# EAGLE design musicpulse (EAGLE 9.4.2)
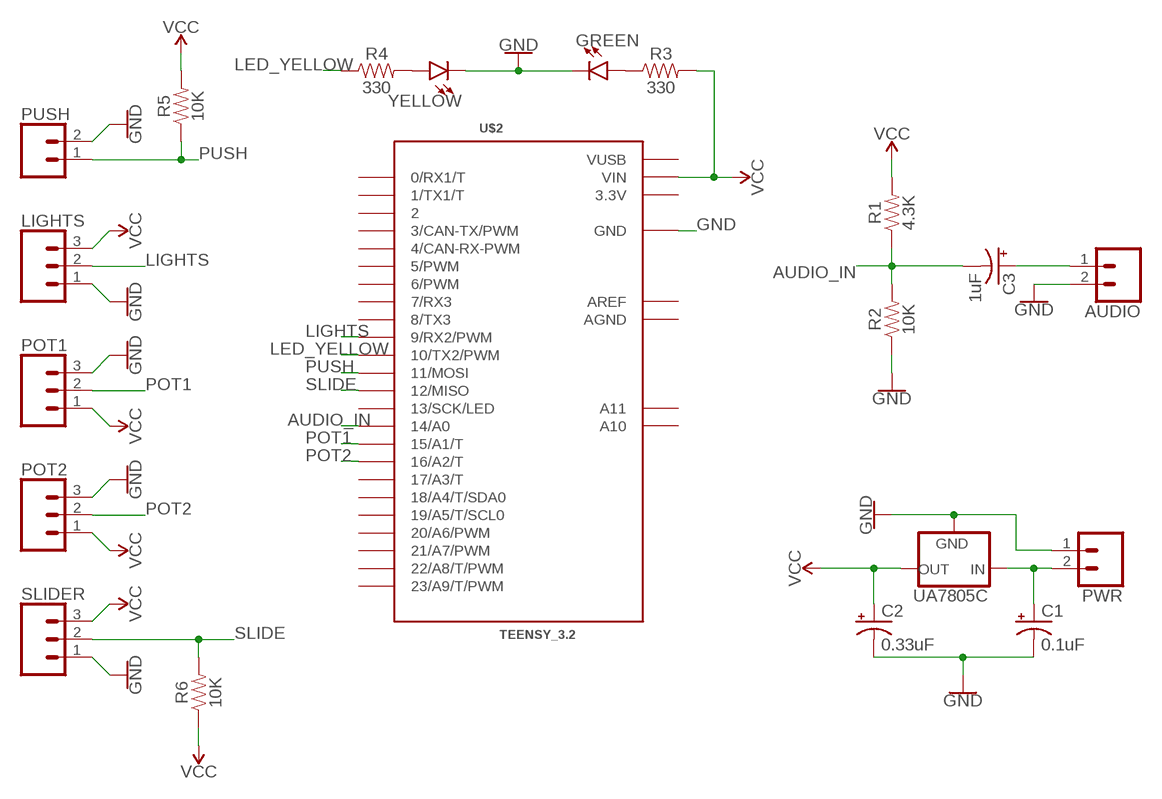
[diagram p0: schematic, sheet 1]

## Parts
AUDIO  CONN_02  [1X02]
C1  0.1uF  10UF-POLAR-RADIAL-2.5MM-25V-20%  [CPOL-RADIAL-2.5MM-5MM]
C2  0.33uF  10UF-POLAR-RADIAL-2.5MM-25V-20%  [CPOL-RADIAL-2.5MM-5MM]
C3  1uF  10UF-POLAR-RADIAL-2.5MM-25V-20%  [CPOL-RADIAL-2.5MM-5MM]
GREEN  LED-3MM-NO_SILK  [LED_3MM-NS]
LIGHTS  CONN_03  [1X03]
POT1  CONN_03  [1X03]
POT2  CONN_03  [1X03]
PUSH  CONN_02  [1X02]
PWR  CONN_02  [1X02]
R1  4.3K  1KOHM-HORIZ-1/4W-1%  [AXIAL-0.3]
R2  10K  1KOHM-HORIZ-1/4W-1%  [AXIAL-0.3]
R3  330  1KOHM-HORIZ-1/4W-1%  [AXIAL-0.3]
R4  330  1KOHM-HORIZ-1/4W-1%  [AXIAL-0.3]
R5  10K  1KOHM-HORIZ-1/4W-1%  [AXIAL-0.3]
R6  10K  1KOHM-HORIZ-1/4W-1%  [AXIAL-0.3]
SLIDER  CONN_03  [1X03]
U$2  TEENSY_3.2  TEENSY_3.1-3.2_DIL+4  [TEENSY_3.0-3.2&LC_DIL+4]
UA7805C  V_REG_78XXSINK  [TO220-IGO]
YELLOW  LED-3MM-NO_SILK  [LED_3MM-NS]

## Nets
AUDIO_IN: C3.2(-) R1.P$1 R2.P$2 U$2.14/A0
GND: AUDIO.2 C1.2(-) C2.2(-) GREEN.K(C) LIGHTS.1 POT1.3 POT2.3 PUSH.2 PWR.1 R2.P$1 SLIDER.1 U$2.GND UA7805C.GND YELLOW.K(C)
LED_YELLOW: R4.P$1 U$2.10(10/TX2/PWM)
LIGHTS: LIGHTS.2 U$2.9(9/RX2/PWM)
N$1: C1.1(+) PWR.2 UA7805C.IN
N$2: R4.P$2 YELLOW.A
N$4: GREEN.A R3.P$1
N$5: AUDIO.1 C3.1(+)
POT1: POT1.2 U$2.15/A1(15/A1/T)
POT2: POT2.2 U$2.16/A2(16/A2/T)
PUSH: PUSH.1 R5.P$1 U$2.11(11/MOSI)
SLIDE: R6.P$2 SLIDER.2 U$2.12(12/MISO)
VCC: C2.1(+) LIGHTS.3 POT1.1 POT2.1 R1.P$2 R3.P$2 R5.P$2 R6.P$1 SLIDER.3 U$2.VIN UA7805C.OUT
Unconnected: U$2.0(0/RX1/T) U$2.1(1/TX1/T) U$2.2 U$2.3(3/CAN-TX/PWM) U$2.4(4/CAN-RX-PWM) U$2.5(5/PWM) U$2.6(6/PWM) U$2.7(7/RX3) U$2.8(8/TX3) U$2.13(13/SCK/LED) U$2.17/A3(17/A3/T) U$2.18/A4(18/A4/T/SDA0) U$2.19/A5(19/A5/T/SCL0) U$2.20/A6(20/A6/PWM) U$2.21/A7(21/A7/PWM) U$2.22/A8(22/A8/T/PWM) U$2.23/A9(23/A9/T/PWM) U$2.A10 U$2.A11

## Power pins joined to a net without a drawn wire
3.3V: U$2.3.3V
AGND: U$2.AGND
AREF: U$2.AREF
VUSB: U$2.VUSB

## Library data of the parts
AUDIO PUSH PWR = SparkFun-Connectors:CONN_02: Multi connection point. Often used as Generic Header-pin footprint for 0.1 inch spaced/style header connections On any of the 0.1 inch spaced packages, you can populate with these: Break Away Headers - Straight <https://www.sparkfun.com/products/116> (PRT-00116) Break Away Male Headers - Right Angle <https://www.sparkfun.com/products/553> (PRT-00553) Female Headers <https://www.sparkfun.com/products/115> (PRT-00115) Break Away Headers - Machine Pin <https://www.sparkfun.com/products/117> (PRT-00117) Break Away Female Headers - Swiss Machine Pin <https://www.sparkfun.com/products/743> (PRT-00743) For SCREWTERMINALS and SPRING TERMINALS visit here: Screw Terimnals on SparkFun.com <https://www.sparkfun.com/search/results?term=Screw+Terminals> (5mm/3.5mm/2.54mm spacing) This device is also useful as a general connection point to wire up your design to another part of your project. Our various solder wires solder well into these plated through hole pads. Hook-Up Wire - Assortment (Stranded, 22 AWG) <https://www.sparkfun.com/products/11375> (PRT-11375) Hook-Up Wire - Assortment (Solid Core, 22 AWG) <https://www.sparkfun.com/products/11367> (PRT-11367) View the entire wire category on our website here <https://www.sparkfun.com/categories/141> Special notes: Molex polarized connector foot print use with: PRT-08233 with associated crimp pins and housings. 2.54_SCREWTERM for use with PRT-10571. 3.5mm Screw Terminal footprints for PRT-08084 5mm Screw Terminal footprints for use with PRT-08432
C1-C3 = SparkFun-Capacitors:10UF-POLAR: 10.0µF polarized capacitors A capacitor is a passive two-terminal electrical component used to store electrical energy temporarily in an electric field.; PROD_ID: CAP-08440; VALUE: 10uF
GREEN YELLOW = SparkFun-LED:LED: LED (Generic) Standard schematic elements and footprints for 5mm, 3mm, 1206, and 0603 sized LEDs. Generic LEDs with no color specified.
LIGHTS POT1 POT2 SLIDER = SparkFun-Connectors:CONN_03: Multi connection point. Often used as Generic Header-pin footprint for 0.1 inch spaced/style header connections On any of the 0.1 inch spaced packages, you can populate with these: Break Away Headers - Straight <https://www.sparkfun.com/products/116> (PRT-00116) Break Away Male Headers - Right Angle <https://www.sparkfun.com/products/553> (PRT-00553) Female Headers <https://www.sparkfun.com/products/115> (PRT-00115) Break Away Headers - Machine Pin <https://www.sparkfun.com/products/117> (PRT-00117) Break Away Female Headers - Swiss Machine Pin <https://www.sparkfun.com/products/743> (PRT-00743) Stackable Header - 3 Pin (Female, 0.1") <https://www.sparkfun.com/products/13875> (PRT-13875) For SCREWTERMINALS and SPRING TERMINALS visit here: Screw Terimnals on SparkFun.com <https://www.sparkfun.com/search/results?term=Screw+Terminals> (5mm/3.5mm/2.54mm spacing) This device is also useful as a general connection point to wire up your design to another part of your project. Our various solder wires solder well into these plated through hole pads. Hook-Up Wire - Assortment (Stranded, 22 AWG) <https://www.sparkfun.com/products/11375> (PRT-11375) Hook-Up Wire - Assortment (Solid Core, 22 AWG) <https://www.sparkfun.com/products/11367> (PRT-11367) View the entire wire category on our website here <https://www.sparkfun.com/categories/141> Special notes: Molex polarized connector foot print use with SKU : PRT-08232 with associated crimp pins and housings.
R1-R6 = SparkFun-Resistors:1KOHM: 1kΩ resistor A resistor is a passive two-terminal electrical component that implements electrical resistance as a circuit element. Resistors act to reduce current flow, and, at the same time, act to lower voltage levels within circuits. - Wikipedia; PROD_ID: RES-12182; VALUE: 1k
U$2 = Teensy_3_and_LC_Series_Boards_v1.4:TEENSY_3.1-3.2_DIL+4: Teensy 3.1 and 3.2 in a DIL package with the inner 4 pins
UA7805C = SparkFun-IC-Power:V_REG_78XX: Voltage Regulator Standard 78xx regulator. IGO (Input Ground Output). Spark Fun Electronics SKU : COM-00107

## Net classes
0 default: width 0.305 mm, drill 0.508 mm, clearance 0.254 mm

## Board
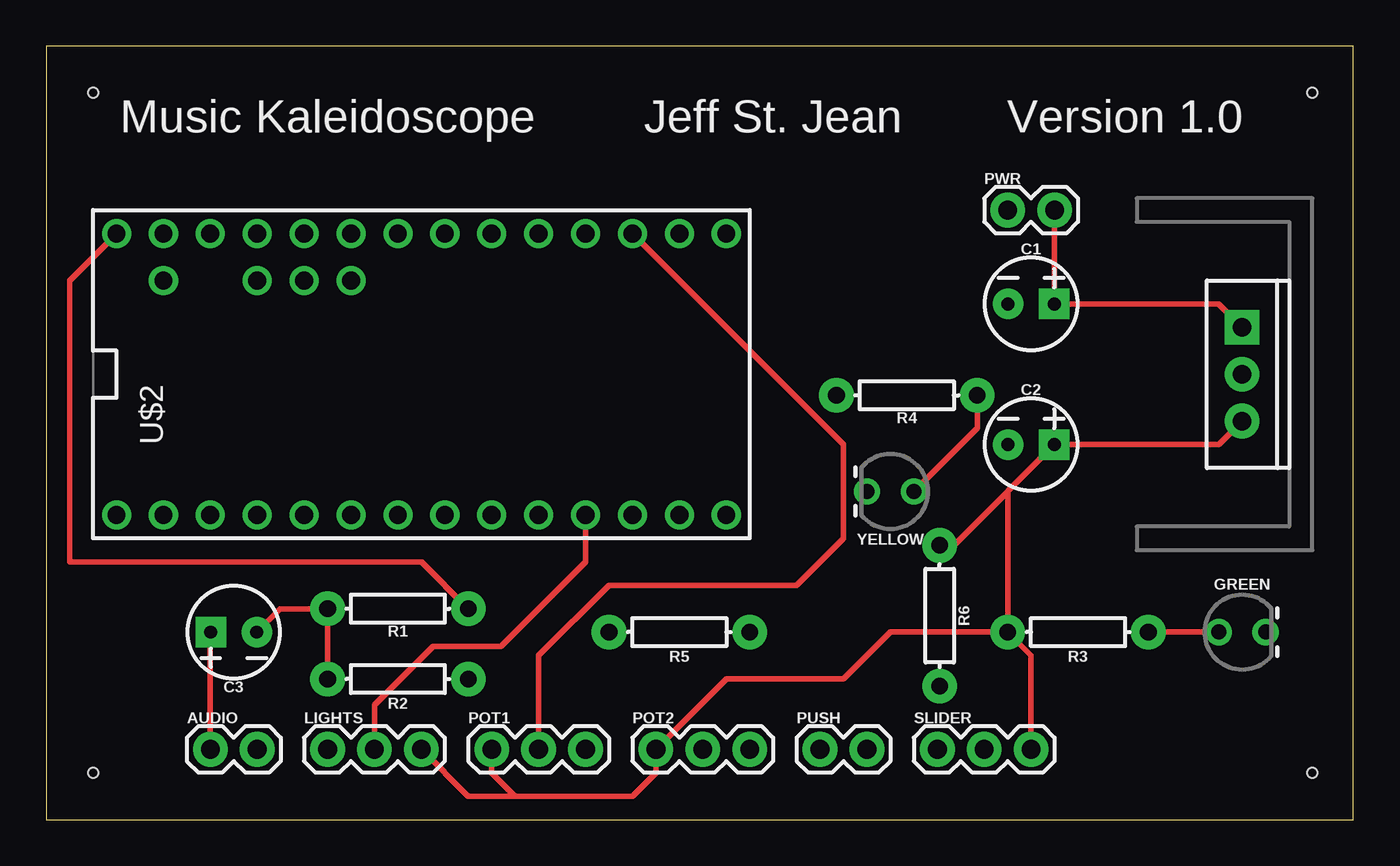
[diagram p1: board, top side]
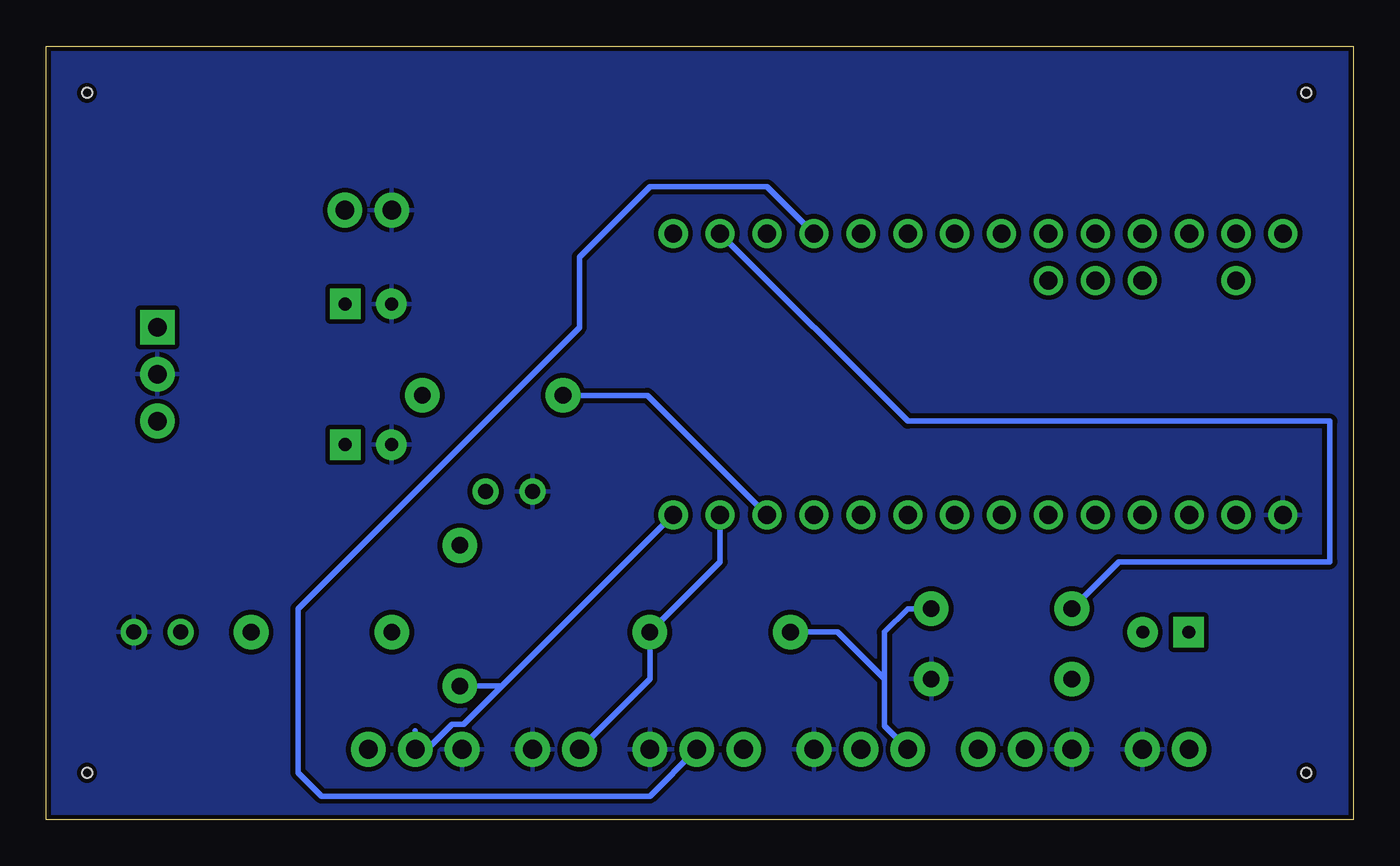
[diagram p2: board, bottom side, seen from below]

Size 70.79 x 41.9 mm. Coordinates in mm from the lower left corner, seen from the top.
Outline: 0,0 70.79,0 70.79,41.9 0,41.9 0,0
Copper layers (1*16): Top 0.035mm / dielectric 1.5mm / Bottom 0.035mm
Design rules "SparkFun": minimum track width 8mil, minimum drill 20mil, track to track 8mil, track to pad 8mil, pad to pad 8mil, via to via 8mil, smd to smd 8mil, copper to edge 10mil, drill to drill 8mil, minimum pad ring 12mil, minimum via ring 10mil, stop-mask expansion 4mil, vias tented up to drill 25mil, thermal gap 10mil
Holes 0.55 mm at 68.58,2.54 2.54,2.54 68.58,39.37 2.54,39.37

### Footprints (pad centres in the part's own frame; a part is rotated, then mirrored left to right if it is on the bottom)
1X02 = drill 1.016 pad 1.88: 1 0,0; 2 2.54,0
CPOL-RADIAL-2.5MM-5MM = drill 0.7 pad 1.651 square: 1 1.25,0 | drill 0.7 pad 1.651: 2 -1.25,0
LED_3MM-NS = drill 0.813: A -1.27,0; K 1.27,0
1X03 = drill 1.016 pad 1.88: 1 0,0; 2 2.54,0; 3 5.08,0
AXIAL-0.3 = drill 0.9 pad 1.88: P$1 -3.81,0; P$2 3.81,0
TEENSY_3.0-3.2&LC_DIL+4 = drill 0.965: 0 -7.62,13.97; 1 -7.62,11.43; 2 -7.62,8.89; 3 -7.62,6.35; 3.3V 7.62,11.43; 4 -7.62,3.81; 5 -7.62,1.27; 6 -7.62,-1.27; 7 -7.62,-3.81; 8 -7.62,-6.35; 9 -7.62,-8.89; 10 -7.62,-11.43; 11 -7.62,-13.97; 12 -7.62,-16.51; 13 7.62,-16.51; 14/A0 7.62,-13.97; 15/A1 7.62,-11.43; 16/A2 7.62,-8.89; 17/A3 7.62,-6.35; 18/A4 7.62,-3.81; 19/A5 7.62,-1.27; 20/A6 7.62,1.27; 21/A7 7.62,3.81; 22/A8 7.62,6.35; 23/A9 7.62,8.89; A10 5.08,6.35; A11 5.08,3.81; AGND 7.62,13.97; AREF 5.08,8.89; GND -7.62,16.51; VIN 7.62,16.51; VUSB 5.08,13.97
TO220-IGO = drill 1 pad 1.88: GND 0,0; OUT 2.54,0 | drill 1 pad 1.88 square: IN -2.54,0

### Placement (x,y rotation side)
AUDIO  8.89,3.81 0 top
C1  53.34,27.94 0 top
C2  53.34,20.32 0 top
C3  10.16,10.16 180 top
GREEN  64.77,10.16 0 top
LIGHTS  15.24,3.81 0 top
POT1  24.13,3.81 0 top
POT2  33.02,3.81 0 top
PUSH  41.91,3.81 0 top
PWR  52.07,33.02 0 top
R1  19.05,11.43 0 top
R2  19.05,7.62 180 top
R3  55.88,10.16 180 top
R4  46.61,22.99 0 top
R5  34.29,10.16 180 top
R6  48.39,11.05 270 top
SLIDER  48.26,3.81 0 top
U$2  20.32,24.13 90 top
UA7805C  64.77,24.13 270 top
YELLOW  45.72,17.78 180 top

### Tracks (layer width: path | path; a pad name or v marks a point on that pad's centre or on a via)
AUDIO_IN
  Top 0.305: C3.2 12.68,11.43 R1.P$1 R2.P$2
  Bottom 0.305: R1.P$1 12.7,13.97 1.27,13.97 1.27,21.59 24.13,21.59 U$2.14/A0
GND
  pour Bottom: -2.54,49.53 -2.54,-3.81 74.93,-3.81 74.93,49.53
LED_YELLOW
  Bottom 0.305: R4.P$1 38.23,22.99 U$2.10
LIGHTS
  Top 0.305: LIGHTS.2 17.78,6.22 20.95,9.4 24.64,9.4 29.21,13.97 U$2.9
N$1
  Top 0.305: UA7805C.IN 63.5,27.94 C1.1 54.61,27.96 PWR.2
N$2
  Top 0.305: YELLOW.A 50.42,21.21 R4.P$2
N$4
  Top 0.305: R3.P$1 GREEN.A
N$5
  Top 0.305: AUDIO.1 8.89,10.14 C3.1
POT1
  Top 0.305: POT1.2 26.67,8.89 30.48,12.7 40.64,12.7 43.18,15.24 43.18,20.32 U$2.15/A1
POT2
  Bottom 0.305: POT2.2 38.1,1.27 55.88,1.27 57.15,2.54 57.15,11.43 41.91,26.67 41.91,30.48 38.1,34.29 31.75,34.29 U$2.16/A2
PUSH
  Bottom 0.305: PUSH.1 38.1,7.62 R5.P$1 34.29,13.97 U$2.11
SLIDE
  Bottom 0.305: 46.1,7.24 48.18,5.16 48.82,5.16 50.16,3.81 SLIDER.2 50.8,4.83 | U$2.12 45.72,7.62 46.1,7.24 | R6.P$2 46.1,7.24
VCC
  Top 0.305: UA7805C.OUT 63.5,20.32 C2.1 52.07,17.8 52.07,17.78 | 52.07,17.78 R3.P$2 | R3.P$2 53.34,8.89 SLIDER.3 | R3.P$2 45.72,10.16 43.18,7.62 36.83,7.62 POT2.1 33.02,2.54 31.75,1.27 25.4,1.27 | 25.4,1.27 24.13,2.54 POT1.1 | 25.4,1.27 22.86,1.27 LIGHTS.3 | R1.P$2 20.32,13.97 1.27,13.97 1.27,29.21 U$2.VIN | R6.P$1 49.15,14.86 52.07,17.78
  Bottom 0.305: R1.P$2 24.13,11.43 25.4,10.16 25.4,7.62 | 25.4,7.62 25.4,5.08 POT1.1 | R5.P$2 27.94,10.16 25.4,7.62

### Text on the board
tPlace: Music Kaleidoscope | Jeff St. Jean | Version 1.0